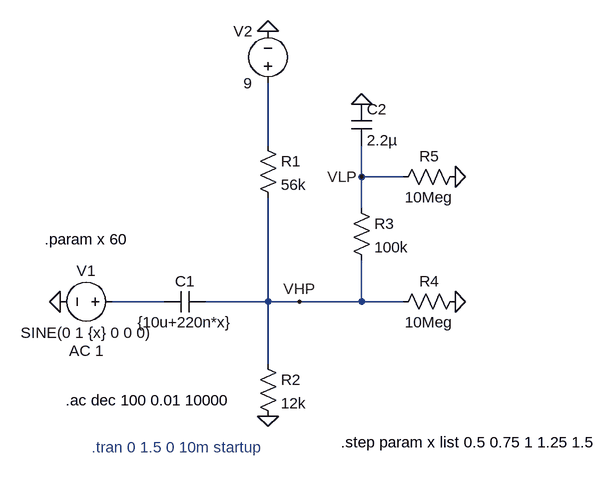
[diagram p0: schematic DCBIAS_WithFilter_Test.asc]
DCBIAS_WithFilter_Test.asc, the LTspice schematic file:
Version 4
SHEET 1 1428 680
WIRE 272 -112 272 -208
WIRE 416 -64 416 -112
WIRE 480 -64 416 -64
WIRE 416 -16 416 -64
WIRE 112 128 32 128
WIRE 272 128 272 -32
WIRE 272 128 176 128
WIRE 320 128 272 128
WIRE 416 128 416 64
WIRE 416 128 320 128
WIRE 480 128 416 128
WIRE 272 224 272 128
FLAG -48 128 0
FLAG 272 -288 0
FLAG 272 304 0
FLAG 416 -176 0
FLAG 560 128 0
FLAG 320 128 VHP
FLAG 416 -64 VLP
FLAG 560 -64 0
SYMBOL cap 176 112 R90
WINDOW 0 0 32 VBottom 2
WINDOW 3 32 32 VTop 2
SYMATTR InstName C1
SYMATTR Value {10u+220n*x}
SYMBOL voltage 48 128 R90
WINDOW 0 -32 56 VBottom 2
WINDOW 3 32 56 VTop 2
WINDOW 123 60 56 VTop 2
WINDOW 39 0 0 Left 0
SYMATTR InstName V1
SYMATTR Value SINE(0 1 {x} 0 0 0)
SYMATTR Value2 AC 1
SYMBOL res 256 -128 R0
SYMATTR InstName R1
SYMATTR Value 56k
SYMBOL voltage 272 -192 R180
WINDOW 0 24 96 Left 2
WINDOW 3 24 16 Left 2
SYMATTR InstName V2
SYMATTR Value 9
SYMBOL res 256 208 R0
SYMATTR InstName R2
SYMATTR Value 12k
SYMBOL cap 400 -176 R0
SYMATTR InstName C2
SYMATTR Value 2.2µ
SYMBOL res 400 -32 R0
SYMATTR InstName R3
SYMATTR Value 100k
SYMBOL res 576 112 R90
WINDOW 0 0 56 VBottom 2
WINDOW 3 32 56 VTop 2
SYMATTR InstName R4
SYMATTR Value 10Meg
SYMBOL res 576 -80 R90
WINDOW 0 0 56 VBottom 2
WINDOW 3 32 56 VTop 2
SYMATTR InstName R5
SYMATTR Value 10Meg
TEXT 0 352 Left 2 ;.tran 0 1.5 0 10m startup
TEXT -72 32 Left 2 !.param x 60
TEXT -40 280 Left 2 !.ac dec 100 0.01 10000
TEXT 384 344 Left 2 !.step param x list 0.5 0.75 1 1.25 1.5

The netlist it stands for:
* DCBIAS_WithFilter_Test.asc
C1 VHP N002 {10u+220n*x}
V1 N002 0 SINE(0 1 {x} 0 0 0) AC 1
R1 N001 VHP 56k
V2 N001 0 9
R2 VHP 0 12k
C2 0 VLP 2.2µ
R3 VLP VHP 100k
R4 0 VHP 10Meg
R5 0 VLP 10Meg
* .tran 0 1.5 0 10m startup
.param x 60
.ac dec 100 0.01 10000
.step param x list 0.5 0.75 1 1.25 1.5
.backanno
.end